# Altium schematic sheet Power.SchDoc
size A4; SheetNumber: 6; SheetTotal: 7
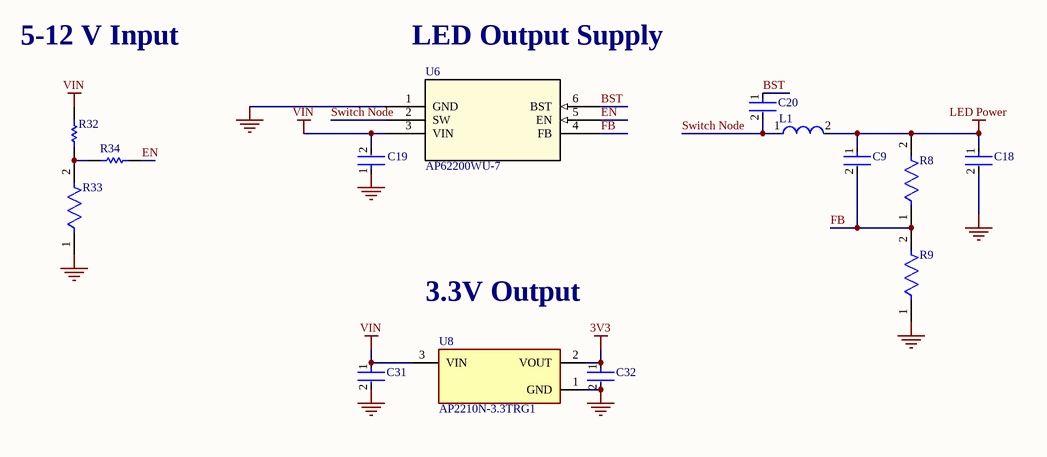
[diagram p0: Power.SchDoc]

## Parts
C9  UMK105CG330JVHF  [FP-0402-L_1_0_0_05-W_0_5-MFG]  (value not drawn)
C18  EMK316BB7226ML-T  [FP-1206-L_3_2_0_3-W_1_6_0-IPC_A]  (value not drawn)
C19  GRM188R6YA475KE15D  [FP-GRM188-0_2-IPC_C]  (value not drawn)
C20  GRM155R71C224KA12D  [FP-GRM155-0_05-IPC_C]  (value not drawn)
C31  GCM21BR71H105MA03L  [FP-GCM21B-0_15-MFG]  (value not drawn)
C32  GCJ21BR71E225KA01L  [FP-GCJ21B-0_3-MFG]  (value not drawn)
L1  LQM21PN1R0NGRD  [FP-LQM21PH_G0-IPC_C]  (value not drawn)
R8  AC0402JR-07200KL  [FP-AC0402-IPC_B]  (value not drawn)
R9  RK73H1ERTTP4422F  [FP-RK73H1E-IPC_C]  (value not drawn)
R32  ERJ-2GEJ204X  [RESC1005X40X25NL05T05]  (value not drawn)
R33  CRCW040250K0FKED  [FP-CRCW0402-e3-IPC_A]  (value not drawn)
R34  RC0402JR-100RL  [RESC1005X40X25NL05T10]  (value not drawn)
U6  AP62200WU-7  [TSOT26-WU_DIO]
U8  AP2210N-3.3TRG1  [FP-SOT23-IPC_C]

## Nets
3V3: C32.1 U8.2(VOUT)
GND: C18.2 C19.1 C31.2 C32.2 R9.1 R33.1 U6.1(GND) U8.1(GND)
LED Power: C9.1 C18.1 L1.2 R8.2
VIN: C19.2 C31.1 R32.2 U6.3(VIN) U8.3(VIN)
BST: C20.1 U6.6(BST)
EN: R34.2 U6.5(EN)
FB: C9.2 R8.1 R9.2 U6.4(FB)
Switch Node: C20.2 L1.1 U6.2(SW)
NetR32_1: R32.1 R33.2 R34.1

## Notes on the sheet
- 5-12 V Input
- LED Output Supply
- 3.3V Output

## Library data of the parts
C9 = CMP-14477-003555-2: None; Voltage Rating (DC): 50V; Tolerance: 5%; Capacitance: 33pF; Mount: Surface Mount; Case Code (Imperial): 0402; Min Operating Temperature: -55°C; Package Quantity: 10000; Halogen Free: Halogen Free; Voltage Rating: 50V; Packaging: Tape and Reel; Thickness: 0.022inch; Ratings: AEC-Q200; Case/Package: 0402; RoHS Compliant: Yes; Length: 0.039inch; Width: 0.02inch; Case Code (Metric): 1005; Max Operating Temperature: 125°C
C18 = CMP-14477-000099-2: None; Tolerance: 20%; Voltage Rating: 16V; Capacitance: 22uF; Dielectric: X7R; Lead Free: Lead Free; Min Operating Temperature: -55°C; Max Operating Temperature: 125°C; Case/Package: 1206; RoHS Compliant: Yes; Case Code (Metric): 3216; Width: 0.063inch; Case Code (Imperial): 1206; Thickness: 0.071inch; Packaging: Tape and Reel; Length: 0.126inch; Mount: Surface Mount
C19 = CMP-2006-02545-2: Chip Multilayer Ceramic Capacitors for General Purpose, 0603, 4.7uF, X5R, 15%, 10%, 35V; Lead Free: Lead Free; Max Operating Temperature: 85°C; Case Code (Imperial): 0603; Capacitance: 4.7uF; Width: 0.8mm; Thickness: 0.031inch; Case Code (Metric): 1608; Min Operating Temperature: -55°C; Voltage Rating (DC): 35V; Dielectric: X5R; Voltage: 35V; Packaging: Tape and Reel; Resistor Type: Ceramic; Weight: 0.000222oz; Mount: Surface Mount; Material: Ceramic; Depth: 0.8mm; Tolerance: 10%; REACH SVHC: No SVHC; Case/Package: 0603; Voltage Rating: 35V; Package Quantity: 4000; Height: 0.8mm; Length: 1.6mm; Termination: SMD/SMT
C20 = CMP-1034-02089-3: Chip Multilayer Ceramic Capacitors for General Purpose, 0402, 0.22uF, X7R, 15%, 10%, 16V; Capacitance: 220nF; Depth: 0.5mm; Dielectric: X7R; Min Operating Temperature: -55°C; Package Quantity: 1; Termination: SMD/SMT; Mount: Surface Mount; Radiation Hardening: No; Height: 0.5mm; Case Code (Metric): 1005; Packaging: Tape and Reel; Material: Ceramic; Voltage: 16V; Voltage Rating (DC): 16V; REACH SVHC: No SVHC; Voltage Rating: 16V; Length: 1mm; Tolerance: 10%; Thickness: 0.022inch; Case Code (Imperial): 0402; Max Operating Temperature: 125°C; Width: 0.02inch; Lead Free: Lead Free; Case/Package: 0402
C31 = CMP-06035-008660-1: Ceramic Capacitor for Automotive 1uF ±20% 50VDC X7R 0805 Embossed T/R
C32 = CMP-06035-015979-1: Multilayer Ceramic Capacitors MLCC - SMD/SMT 0805 2.2uF 10%, 25VDC,  X7R 15%
L1 = CMP-06042-017027-1: Multilayer Type Inductor for Power Lines, 0805 (2012), 1μH, 30%, 0.0825Ω, 1.3A; Test Frequency: 1MHz; Shielding: Shielded; Self Resonant Frequency: 50MHz; DC Resistance (DCR): 82.5mR; Inductance: 1uH; Core Material: Ferrite; Inductance Tolerance: 30%; Military Standard: Not; Height - Seated (Max): 0.039inch; Max DC Current: 1.3A; Depth: 1.4mm; Packaging: Tape and Reel; Mount: Surface Mount; Width: 0.049inch; Case Code (Imperial): 0805; RoHS Compliant: Yes; Height: 0.9mm; Case/Package: 0805; Max Operating Temperature: 125°C; Min Operating Temperature: -55°C; REACH SVHC: No SVHC; DC Current: 1.3A; Current Rating: 1.3A; Weight: 0.000194oz; Case Code (Metric): 2012; Termination: SMD/SMT; Length: 2mm; Series: LQM21PN_GR; Tolerance: 30%; Package Quantity: 4000
R8 = CMP-03412-037959-1: RES 200kΩ ±5% 0.063W 0402; Power Rating: 62.5mW; Max Power Dissipation: 63mW; Resistance: 200kR; Temperature Coefficient: 100ppm/°C; Voltage Rating: 50V; Width: 0.5mm; Packaging: Tape and Reel; Termination: SMD/SMT; Case Code (Imperial): 0402; Features: Moisture Resistant; Case/Package: 0402; RoHS Compliant: Yes; Series: AC; Tolerance: 5%; Case Code (Metric): 1005; Height: 0.015inch; Resistor Type: Thick Film; Max Operating Temperature: 155°C; Length: 0.039inch; Number of Terminations: 2; Min Operating Temperature: -55°C
R9 = CMP-04015-107788-1: 44.2kΩ ±1% 0.1W Chip Resistor 0402 Flat Chip (Anti-Sulfuration) AEC-Q200 Qualified; Resistance: 44.2kR; Power Rating: 63mW; Temperature Coefficient: 100ppm/°C; Voltage Rating: 50V; Max Operating Temperature: 155°C; Tolerance: 1%; Height: 0.35mm; Package Quantity: 10000; Length: 1mm; Case Code (Imperial): 0402; Packaging: Tape and Reel; Min Operating Temperature: -55°C; Width: 0.5mm; Case/Package: 0402; Case Code (Metric): 1005; Weight: 2.3E-05oz; Termination: SMD/SMT
R32 = CMP-2002-00484-1: Manufacturer: Panasonic; Part Number: ERJ-2GEJ204X
R33 = CMP-02407-005152-1: RES Thick Film, 50kΩ, 1%, 0.063W, 100ppm/°C, 0402; Power Rating: 63mW; Voltage Rating: 50V; Resistance: 50kR; Package Quantity: 10000; Case/Package: 0402; Max Operating Temperature: 155°C; Case Code (Metric): 1005; Termination: SMD/SMT; Lead Free: Lead Free; Height: 0.35mm; Width: 0.5mm; Packaging: Tape and Reel; Min Operating Temperature: -55°C; Length: 1mm; Tolerance: 1%; Case Code (Imperial): 0402; Weight: 2.3E-05oz
R34 = CMP-2002-06970-1: Manufacturer: Yageo; Part Number: RC0402JR-100RL
U6 = AP62200WU-7: No Description Available; Manufacturer_Name: Diodes Inc; Copyright: Copyright (C) 2026 Ultra Librarian. All rights reserved.; Manufacturer_Part_Number: AP62200WU-7; RefDes: RefDes; Type: Type
U8 = CMP-12756-000036-1: IC REG LINEAR 3.3V 300MA SOT23-3; Accuracy: 1%; Max Input Voltage: 13.2V; Number of Outputs: 1; Polarity: Positive; Power Supply Rejection Ratio (PSRR): 75dB; Quiescent Current: 150uA; Min Input Voltage: 2.5V; Output Type: Fixed; Dropout Voltage: 250mV; Height: 1.3mm; Weight: 0.000282oz; Packaging: Tape and Reel; Length: 3.02mm; Width: 1.7mm; Max Operating Temperature: 125°C; Output Voltage: 3.3V; Min Operating Temperature: -40°C; Output Current: 300mA; Number of Pins: 3; Number of Regulators: 1; Max Output Current: 300mA; Mount: Surface Mount; Case/Package: SOT-23-3; Package Quantity: 3000